# EAGLE schematic serre light v1 (EAGLE 9.3.0)
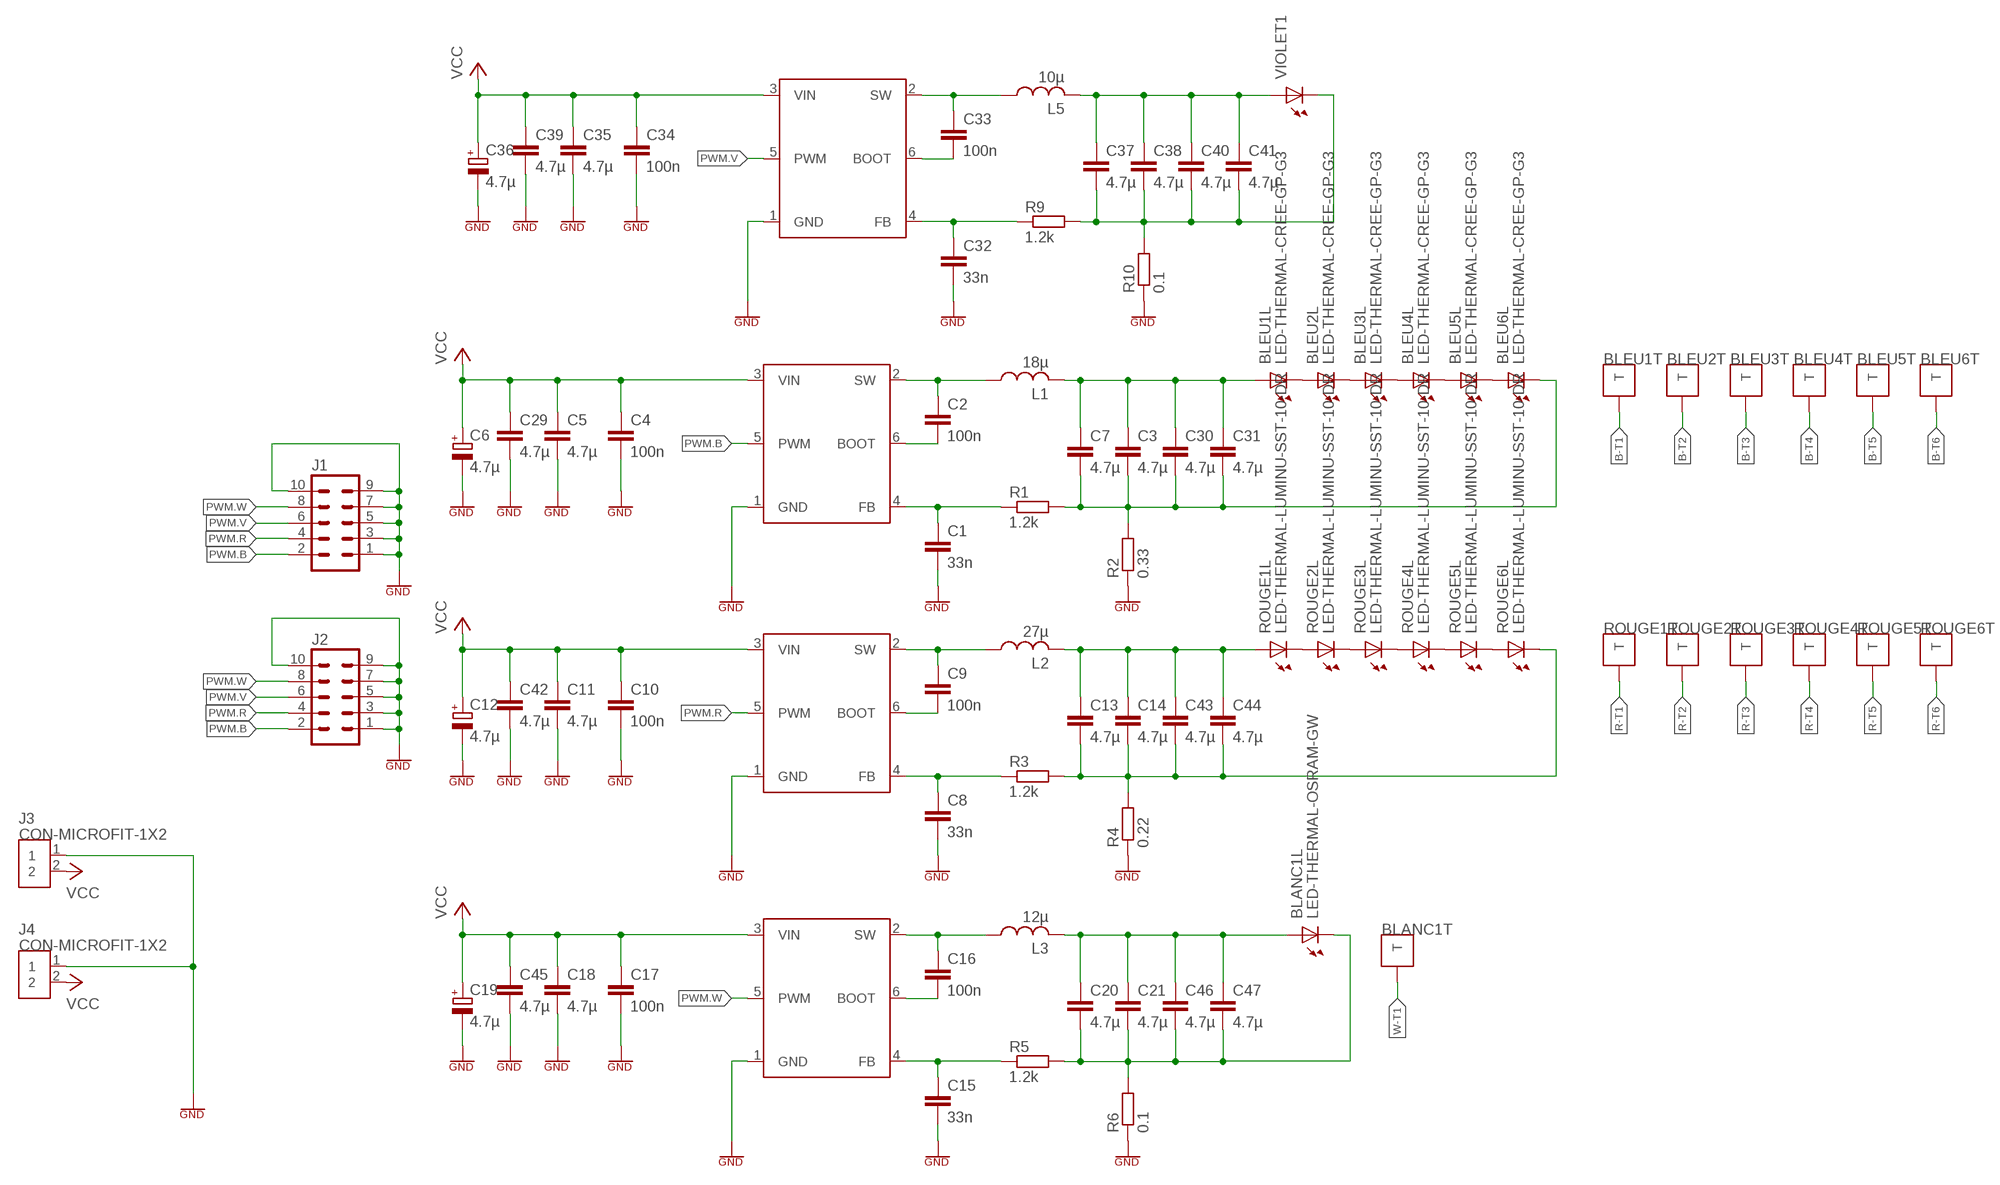
[diagram p0: schematic, sheet 1]

## Parts
BLANC1  LED-THERMAL-OSRAM-GW  [LED-OSRAM-GW]
BLEU1  LED-THERMAL-CREE-GP-G3  [LED-CREE-GP-G3]
BLEU2  LED-THERMAL-CREE-GP-G3  [LED-CREE-GP-G3]
BLEU3  LED-THERMAL-CREE-GP-G3  [LED-CREE-GP-G3]
BLEU4  LED-THERMAL-CREE-GP-G3  [LED-CREE-GP-G3]
BLEU5  LED-THERMAL-CREE-GP-G3  [LED-CREE-GP-G3]
BLEU6  LED-THERMAL-CREE-GP-G3  [LED-CREE-GP-G3]
C1  33n  CC0603  [C0603]
C2  100n  CC0603  [C0603]
C3  4.7µ  C-EUC1210  [C1210]
C4  100n  CC0805  [C0805]
C5  4.7µ  C-EUC1210  [C1210]
C6  4.7µ  CPOL-B  [CAP-TANT-B]
C7  4.7µ  C-EUC1210  [C1210]
C8  33n  CC0603  [C0603]
C9  100n  CC0603  [C0603]
C10  100n  CC0805  [C0805]
C11  4.7µ  C-EUC1210  [C1210]
C12  4.7µ  CPOL-B  [CAP-TANT-B]
C13  4.7µ  C-EUC1210  [C1210]
C14  4.7µ  C-EUC1210  [C1210]
C15  33n  CC0603  [C0603]
C16  100n  CC0603  [C0603]
C17  100n  CC0805  [C0805]
C18  4.7µ  C-EUC1210  [C1210]
C19  4.7µ  CPOL-B  [CAP-TANT-B]
C20  4.7µ  C-EUC1210  [C1210]
C21  4.7µ  C-EUC1210  [C1210]
C29  4.7µ  C-EUC1210  [C1210]
C30  4.7µ  C-EUC1210  [C1210]
C31  4.7µ  C-EUC1210  [C1210]
C32  33n  CC0603  [C0603]
C33  100n  CC0603  [C0603]
C34  100n  CC0805  [C0805]
C35  4.7µ  C-EUC1210  [C1210]
C36  4.7µ  CPOL-B  [CAP-TANT-B]
C37  4.7µ  C-EUC1210  [C1210]
C38  4.7µ  C-EUC1210  [C1210]
C39  4.7µ  C-EUC1210  [C1210]
C40  4.7µ  C-EUC1210  [C1210]
C41  4.7µ  C-EUC1210  [C1210]
C42  4.7µ  C-EUC1210  [C1210]
C43  4.7µ  C-EUC1210  [C1210]
C44  4.7µ  C-EUC1210  [C1210]
C45  4.7µ  C-EUC1210  [C1210]
C46  4.7µ  C-EUC1210  [C1210]
C47  4.7µ  C-EUC1210  [C1210]
IC1  TPS54201  [SOT23-6]
IC2  TPS54201  [SOT23-6]
IC3  TPS54201  [SOT23-6]
IC5  TPS54201  [SOT23-6]
J1  ML10  [ML10]
J2  ML10  [ML10]
J3  CON-MICROFIT-1X2  [MICROFIT-1X2]
J4  CON-MICROFIT-1X2  [MICROFIT-1X2]
L1  18µ  L-MSS1038  [L-COILCRAFT-MSS1038]
L2  27µ  L-MSS1038  [L-COILCRAFT-MSS1038]
L3  12µ  L-MSS1038  [L-COILCRAFT-MSS1038]
L5  10µ  L-MSS1038  [L-COILCRAFT-MSS1038]
R1  1.2k  RR0805  [R0805]
R2  0.33  R-EU_R1206  [R1206]
R3  1.2k  RR0805  [R0805]
R4  0.22  R-EU_R1206  [R1206]
R5  1.2k  RR0805  [R0805]
R6  0.1  R-EU_R1206  [R1206]
R9  1.2k  RR0805  [R0805]
R10  0.1  R-EU_R1206  [R1206]
ROUGE1  LED-THERMAL-LUMINU-SST-10-DR  [LED-LUMINU-SST-10-DR]
ROUGE2  LED-THERMAL-LUMINU-SST-10-DR  [LED-LUMINU-SST-10-DR]
ROUGE3  LED-THERMAL-LUMINU-SST-10-DR  [LED-LUMINU-SST-10-DR]
ROUGE4  LED-THERMAL-LUMINU-SST-10-DR  [LED-LUMINU-SST-10-DR]
ROUGE5  LED-THERMAL-LUMINU-SST-10-DR  [LED-LUMINU-SST-10-DR]
ROUGE6  LED-THERMAL-LUMINU-SST-10-DR  [LED-LUMINU-SST-10-DR]
VIOLET1  LED-LUXEON-UV-U2  [LED-LUXEON-UV-U2]

## Nets
B-T1: BLEU1.THERMAL(T:T)
B-T2: BLEU2.THERMAL(T:T)
B-T3: BLEU3.THERMAL(T:T)
B-T4: BLEU4.THERMAL(T:T)
B-T5: BLEU5.THERMAL(T:T)
B-T6: BLEU6.THERMAL(T:T)
GND: C1.2 C4.2 C5.2 C6.- C8.2 C10.2 C11.2 C12.- C15.2 C17.2 C18.2 C19.- C29.2 C32.2 C34.2 C35.2 C36.- C39.2 C42.2 C45.2 IC1.1(GND) IC2.1(GND) IC3.1(GND) IC5.1(GND) J1.1 J1.3 J1.5 J1.7 J1.9 J1.10 J2.1 J2.3 J2.5 J2.7 J2.9 J2.10 J3.1 J4.1 R2.1 R4.1 R6.1 R10.1
N$1: BLEU2.C(L:C) BLEU3.A(L:A)
N$2: BLEU1.C(L:C) BLEU2.A(L:A)
N$3: BLEU3.C(L:C) BLEU4.A(L:A)
N$4: BLEU4.C(L:C) BLEU5.A(L:A)
N$5: ROUGE1.C(L:C) ROUGE2.A(L:A)
N$6: ROUGE2.C(L:C) ROUGE3.A(L:A)
N$7: ROUGE3.C(L:C) ROUGE4.A(L:A)
N$8: ROUGE5.C(L:C) ROUGE6.A(L:A)
N$9: ROUGE4.C(L:C) ROUGE5.A(L:A)
N$10: BLEU5.C(L:C) BLEU6.A(L:A)
N$15: C1.1 IC1.4(FB) R1.1
N$16: C2.1 IC1.2(SW) L1.1
N$17: C2.2 IC1.6(BOOT)
N$18: BLEU6.C(L:C) C3.2 C7.2 C30.2 C31.2 R1.2 R2.2
N$19: C8.1 IC2.4(FB) R3.1
N$20: BLEU1.A(L:A) C3.1 C7.1 C30.1 C31.1 L1.2
N$22: C9.1 IC2.2(SW) L2.1
N$23: C9.2 IC2.6(BOOT)
N$24: C13.2 C14.2 C43.2 C44.2 R3.2 R4.2 ROUGE6.C(L:C)
N$25: C13.1 C14.1 C43.1 C44.1 L2.2 ROUGE1.A(L:A)
N$26: C15.1 IC3.4(FB) R5.1
N$27: C16.1 IC3.2(SW) L3.1
N$28: C16.2 IC3.6(BOOT)
N$29: BLANC1.C(L:C) C20.2 C21.2 C46.2 C47.2 R5.2 R6.2
N$30: BLANC1.A(L:A) C20.1 C21.1 C46.1 C47.1 L3.2
N$36: C32.1 IC5.4(FB) R9.1
N$37: C33.1 IC5.2(SW) L5.1
N$38: C33.2 IC5.6(BOOT)
N$39: C37.2 C38.2 C40.2 C41.2 R9.2 R10.2 VIOLET1.C
N$40: C37.1 C38.1 C40.1 C41.1 L5.2 VIOLET1.A
PWM.B: IC1.5(PWM) J1.2 J2.2
PWM.R: IC2.5(PWM) J1.4 J2.4
PWM.V: IC5.5(PWM) J1.6 J2.6
PWM.W: IC3.5(PWM) J1.8 J2.8
R-T1: ROUGE1.THERMAL(T:T)
R-T2: ROUGE2.THERMAL(T:T)
R-T3: ROUGE3.THERMAL(T:T)
R-T4: ROUGE4.THERMAL(T:T)
R-T5: ROUGE5.THERMAL(T:T)
R-T6: ROUGE6.THERMAL(T:T)
VCC: C4.1 C5.1 C6.+ C10.1 C11.1 C12.+ C17.1 C18.1 C19.+ C29.1 C34.1 C35.1 C36.+ C39.1 C42.1 C45.1 IC1.3(VIN) IC2.3(VIN) IC3.3(VIN) IC5.3(VIN) J3.2 J4.2
W-T1: BLANC1.THERMAL(T:T)

## Library data of the parts
BLANC1 BLEU1-BLEU6 ROUGE1-ROUGE6 = Bonelli:LED-THERMAL
C1 C2 C4 C8-C10 C15-C17 C32-C34 = Bonelli:C
C3 C5 C7 C11 C13 C14 C18 C20 C21 C29-C31 C35 C37-C47 = rcl:C-EU: CAPACITOR, European symbol
C6 C12 C19 C36 = Bonelli:CPOL
IC1-IC3 IC5 = Bonelli:TPS54201
J1 J2 = con-harting-ml:ML10: HARTING; OC_FARNELL: unknown; OC_NEWARK: unknown
J3 J4 = Bonelli:CON-MICROFIT-1X2; FAB: MOLEX; FAB-REF: 43650-0228; MOUSER: 538-43650-0228
L1 = Bonelli:L; FARNELL: 2288206
L2 = Bonelli:L; FARNELL: 2288208
L3 = Bonelli:L; FARNELL: 2288210
L5 = Bonelli:L; FARNELL: 2288225
R1 R3 R5 R9 = Bonelli:R
R2 = rcl:R-EU_: RESISTOR, European symbol; FARNELL: 2328126
R4 = rcl:R-EU_: RESISTOR, European symbol; FARNELL: 2824735
R6 = rcl:R-EU_: RESISTOR, European symbol; FARNELL: 1100335
R10 = rcl:R-EU_: RESISTOR, European symbol; FARNELL: 1099913
VIOLET1 = Bonelli:LED-*: 0603 Rouge : Farnell 1685073